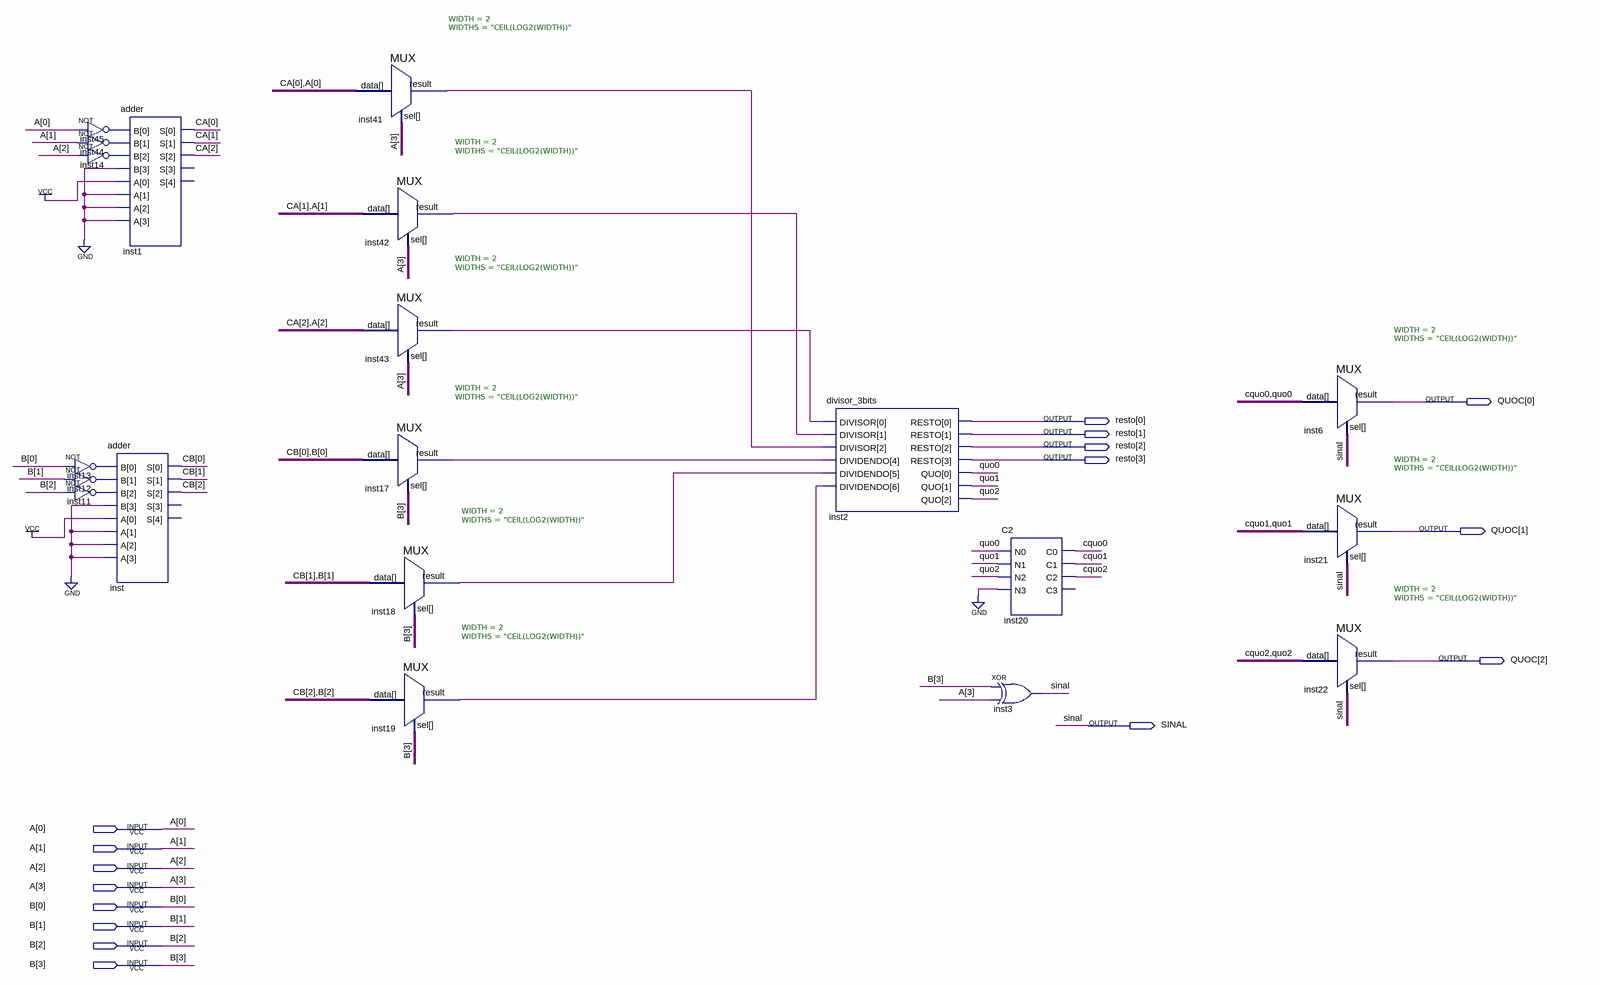
[diagram p0: schematic sheet]
// Quartus schematic divisor_C2.bdf as structural Verilog: 20 symbols, 16 pins
module divisor_C2 (
  input  [3:0] A,
  input  [3:0] B,
  output [2:0] QUOC,
  output [3:0] resto,
  output SINAL
);

  wire cquo0, cquo1, cquo2, inst11_out, inst12_out, inst13_out, inst14_out, inst17_result, inst18_result,
       inst19_result, inst41_result, inst42_result, inst43_result, inst44_out, inst45_out, quo0, quo1, quo2;
  wire [2:0] CA, CB;
  wire [4:0] inst_s_open;  // unused outputs
  wire [4:0] inst1_s_open;  // unused outputs

  not inst45 (inst45_out, A[0]);
  not inst44 (inst44_out, A[1]);
  not inst14 (inst14_out, A[2]);
  not inst13 (inst13_out, B[0]);
  not inst12 (inst12_out, B[1]);
  not inst11 (inst11_out, B[2]);
  adder inst1 (.B({1'b0, inst14_out, inst44_out, inst45_out}), .A(4'b0001), .S({inst1_s_open[4:3], CA}));
  adder inst (.B({1'b0, inst11_out, inst12_out, inst13_out}), .A(4'b0001), .S({inst_s_open[4:3], CB}));
  MUX #(.WIDTH(2), .WIDTHS("CEIL(LOG2(WIDTH))")) inst41 (.data({CA[0], A[0]}), .sel(A[3]), .result(inst41_result));
  MUX #(.WIDTH(2), .WIDTHS("CEIL(LOG2(WIDTH))")) inst42 (.data({CA[1], A[1]}), .sel(A[3]), .result(inst42_result));
  MUX #(.WIDTH(2), .WIDTHS("CEIL(LOG2(WIDTH))")) inst43 (.data({CA[2], A[2]}), .sel(A[3]), .result(inst43_result));
  MUX #(.WIDTH(2), .WIDTHS("CEIL(LOG2(WIDTH))")) inst17 (.data({CB[0], B[0]}), .sel(B[3]), .result(inst17_result));
  MUX #(.WIDTH(2), .WIDTHS("CEIL(LOG2(WIDTH))")) inst18 (.data({CB[1], B[1]}), .sel(B[3]), .result(inst18_result));
  MUX #(.WIDTH(2), .WIDTHS("CEIL(LOG2(WIDTH))")) inst19 (.data({CB[2], B[2]}), .sel(B[3]), .result(inst19_result));
  divisor_3bits inst2 (
    .DIVISOR({inst41_result, inst42_result, inst43_result}),
    .DIVIDENDO({inst19_result, inst18_result, inst17_result}), .RESTO(resto), .QUO({quo2, quo1, quo0}));
  C2 inst20 (.N0(quo0), .N1(quo1), .N2(quo2), .N3(1'b0), .C0(cquo0), .C1(cquo1), .C2(cquo2));  // open: C3
  xor inst3 (SINAL, B[3], A[3]);
  MUX #(.WIDTH(2), .WIDTHS("CEIL(LOG2(WIDTH))")) inst6 (.data({cquo0, quo0}), .sel(SINAL), .result(QUOC[0]));
  MUX #(.WIDTH(2), .WIDTHS("CEIL(LOG2(WIDTH))")) inst21 (.data({cquo1, quo1}), .sel(SINAL), .result(QUOC[1]));
  MUX #(.WIDTH(2), .WIDTHS("CEIL(LOG2(WIDTH))")) inst22 (.data({cquo2, quo2}), .sel(SINAL), .result(QUOC[2]));
endmodule
